# EAGLE design tape_smd2 (EAGLE 6.4)
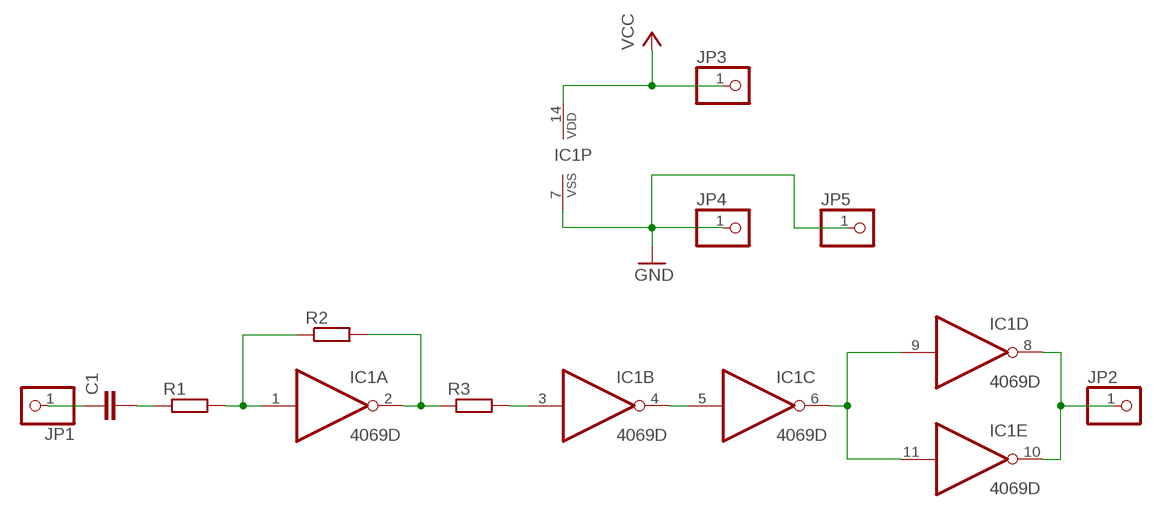
[diagram p0: schematic, sheet 1]

## Parts
C1  C-EUC0805  [C0805]
IC1  4069D  [SO14]
JP1  PINHD-1X1  [1X01]
JP2  PINHD-1X1  [1X01]
JP3  PINHD-1X1  [1X01]
JP4  PINHD-1X1  [1X01]
JP5  PINHD-1X1  [1X01]
R1  R-EU_R0805  [R0805]
R2  R-EU_R0805  [R0805]
R3  R-EU_R0805  [R0805]

## Nets
GND: IC1.7(P:VSS) JP4.1 JP5.1
N$1: C1.1 JP1.1
N$2: C1.2 R1.1
N$3: IC1.1(A:I) R1.2 R2.1
N$4: IC1.2(A:O) R2.2 R3.1
N$5: IC1.3(B:I) R3.2
N$6: IC1.4(B:O) IC1.5(C:I)
N$7: IC1.6(C:O) IC1.9(D:I) IC1.11(E:I)
N$9: IC1.8(D:O) IC1.10(E:O) JP2.1
VCC: IC1.14(P:VDD) JP3.1
Unconnected: IC1.12(F:O) IC1.13(F:I)

## Library data of the parts
C1 = rcl:C-EU: CAPACITOR, European symbol
IC1 = 40xx:4069: Hex INVERTER
JP1-JP5 = pinhead:PINHD-1X1: PIN HEADER
R1-R3 = rcl:R-EU_: RESISTOR, European symbol

## Board
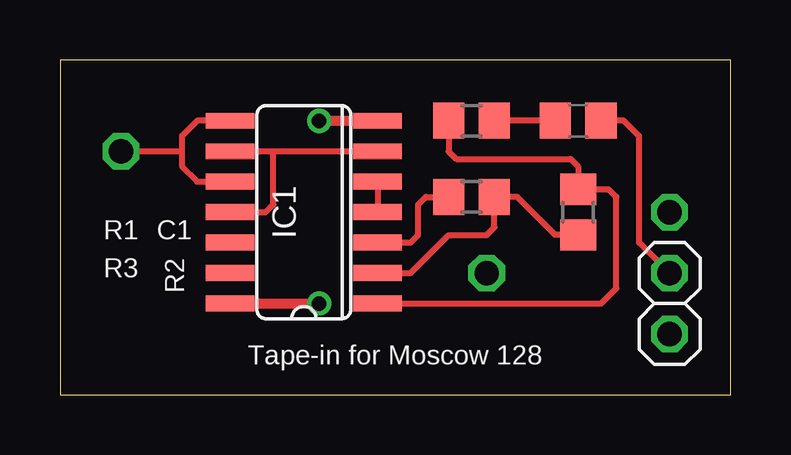
[diagram p1: board, top side]
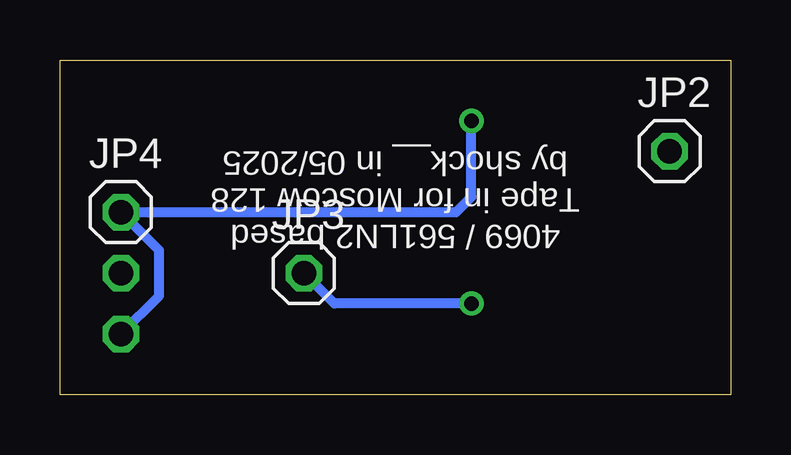
[diagram p2: board, bottom side, seen from below]

Size 27.94 x 13.97 mm. Coordinates in mm from the lower left corner, seen from the top.
Outline: 0,0 27.94,0 27.94,13.97 0,13.97 0,0
Copper layers (1*16): Top 0.035mm / dielectric 1.5mm / Bottom 0.035mm
Design rules "default": minimum track width 10mil, minimum drill 24mil, track to track 8mil, track to pad 8mil, pad to pad 8mil, via to via 8mil, smd to smd 8mil, copper to edge 40mil, drill to drill 8mil, minimum pad ring 10mil, minimum via ring 8mil, stop-mask expansion 4mil, vias tented up to drill 0mil, thermal gap 10mil

### Footprints (pad centres in the part's own frame; a part is rotated, then mirrored left to right if it is on the bottom)
C0805 = smd 1.3 x 1.5: 1 -0.95,0; 2 0.95,0
SO14 = smd 0.66 x 2.032: 1 -3.81,-3.073; 2 -2.54,-3.073; 3 -1.27,-3.073; 4 0,-3.073; 5 1.27,-3.073; 6 2.54,-3.073; 7 3.81,-3.073; 8 3.81,3.073; 9 2.54,3.073; 10 1.27,3.073; 11 0,3.073; 12 -1.27,3.073; 13 -2.54,3.073; 14 -3.81,3.073
1X01 = drill 1.016 octagon: 1 0,0
R0805 = smd 1.3 x 1.5: 1 -0.95,0; 2 0.95,0

### Placement (x,y rotation side)
C1  21.59,11.43 180 top
IC1  10.16,7.62 90 top
JP1  25.4,5.08 0 top
JP2  2.54,10.16 0 bottom
JP3  17.78,5.08 0 bottom
JP4  25.4,7.62 0 bottom
JP5  25.4,2.54 0 top
R1  17.15,11.43 180 top
R2  21.59,7.62 270 top
R3  17.15,8.25 180 top

### Tracks (layer width: path | path; a pad name or v marks a point on that pad's centre or on a via)
GND  (via drill 0.6)
  Top 0.406: v10.8,11.43 IC1.7
  Bottom 0.406: v10.8,11.43 10.8,8.25 11.43,7.62 JP4.1 23.81,6.03 23.81,4.13 JP5.1
N$1
  Top 0.254: JP1.1 24.13,6.35 24.13,10.79 23.5,11.43 C1.1
N$2
  Top 0.254: C1.2 R1.1
N$3
  Top 0.254: R1.2 16.2,10.16 16.51,9.84 21.27,9.84 21.59,9.52 R2.1 22.86,8.57 23.18,8.25 23.18,4.45 22.54,3.81 IC1.1
N$4
  Top 0.254: R2.2 20.64,6.67 19.05,8.25 R3.1 18.1,6.98 17.78,6.67 16.19,6.67 14.61,5.08 IC1.2
N$5
  Top 0.254: IC1.3 14.61,6.35 14.92,6.67 14.92,7.94 15.24,8.25 R3.2
N$6
  Top 0.254: IC1.5 IC1.4
N$7
  Top 0.254: IC1.9 8.89,10.16 | 8.89,10.16 IC1.6 | IC1.11 8.57,7.62 8.89,7.94 8.89,10.16
N$9
  Top 0.254: IC1.8 5.72,11.43 5.08,10.79 5.08,10.16 | 5.08,10.16 5.08,9.52 5.72,8.89 IC1.10 | JP2.1 5.08,10.16
VCC  (via drill 0.6)
  Top 0.406: IC1.14 v10.8,3.81
  Bottom 0.406: v10.8,3.81 16.51,3.81 JP3.1

### Text on the board
tPlace: Tape-in for Moscow 128
bPlace: 4069 / 561LN2 based / Tape in for Moscow 128 / by shock__ in 05/2025